# Altium project RM2022核心板V2.0.PrjPcb
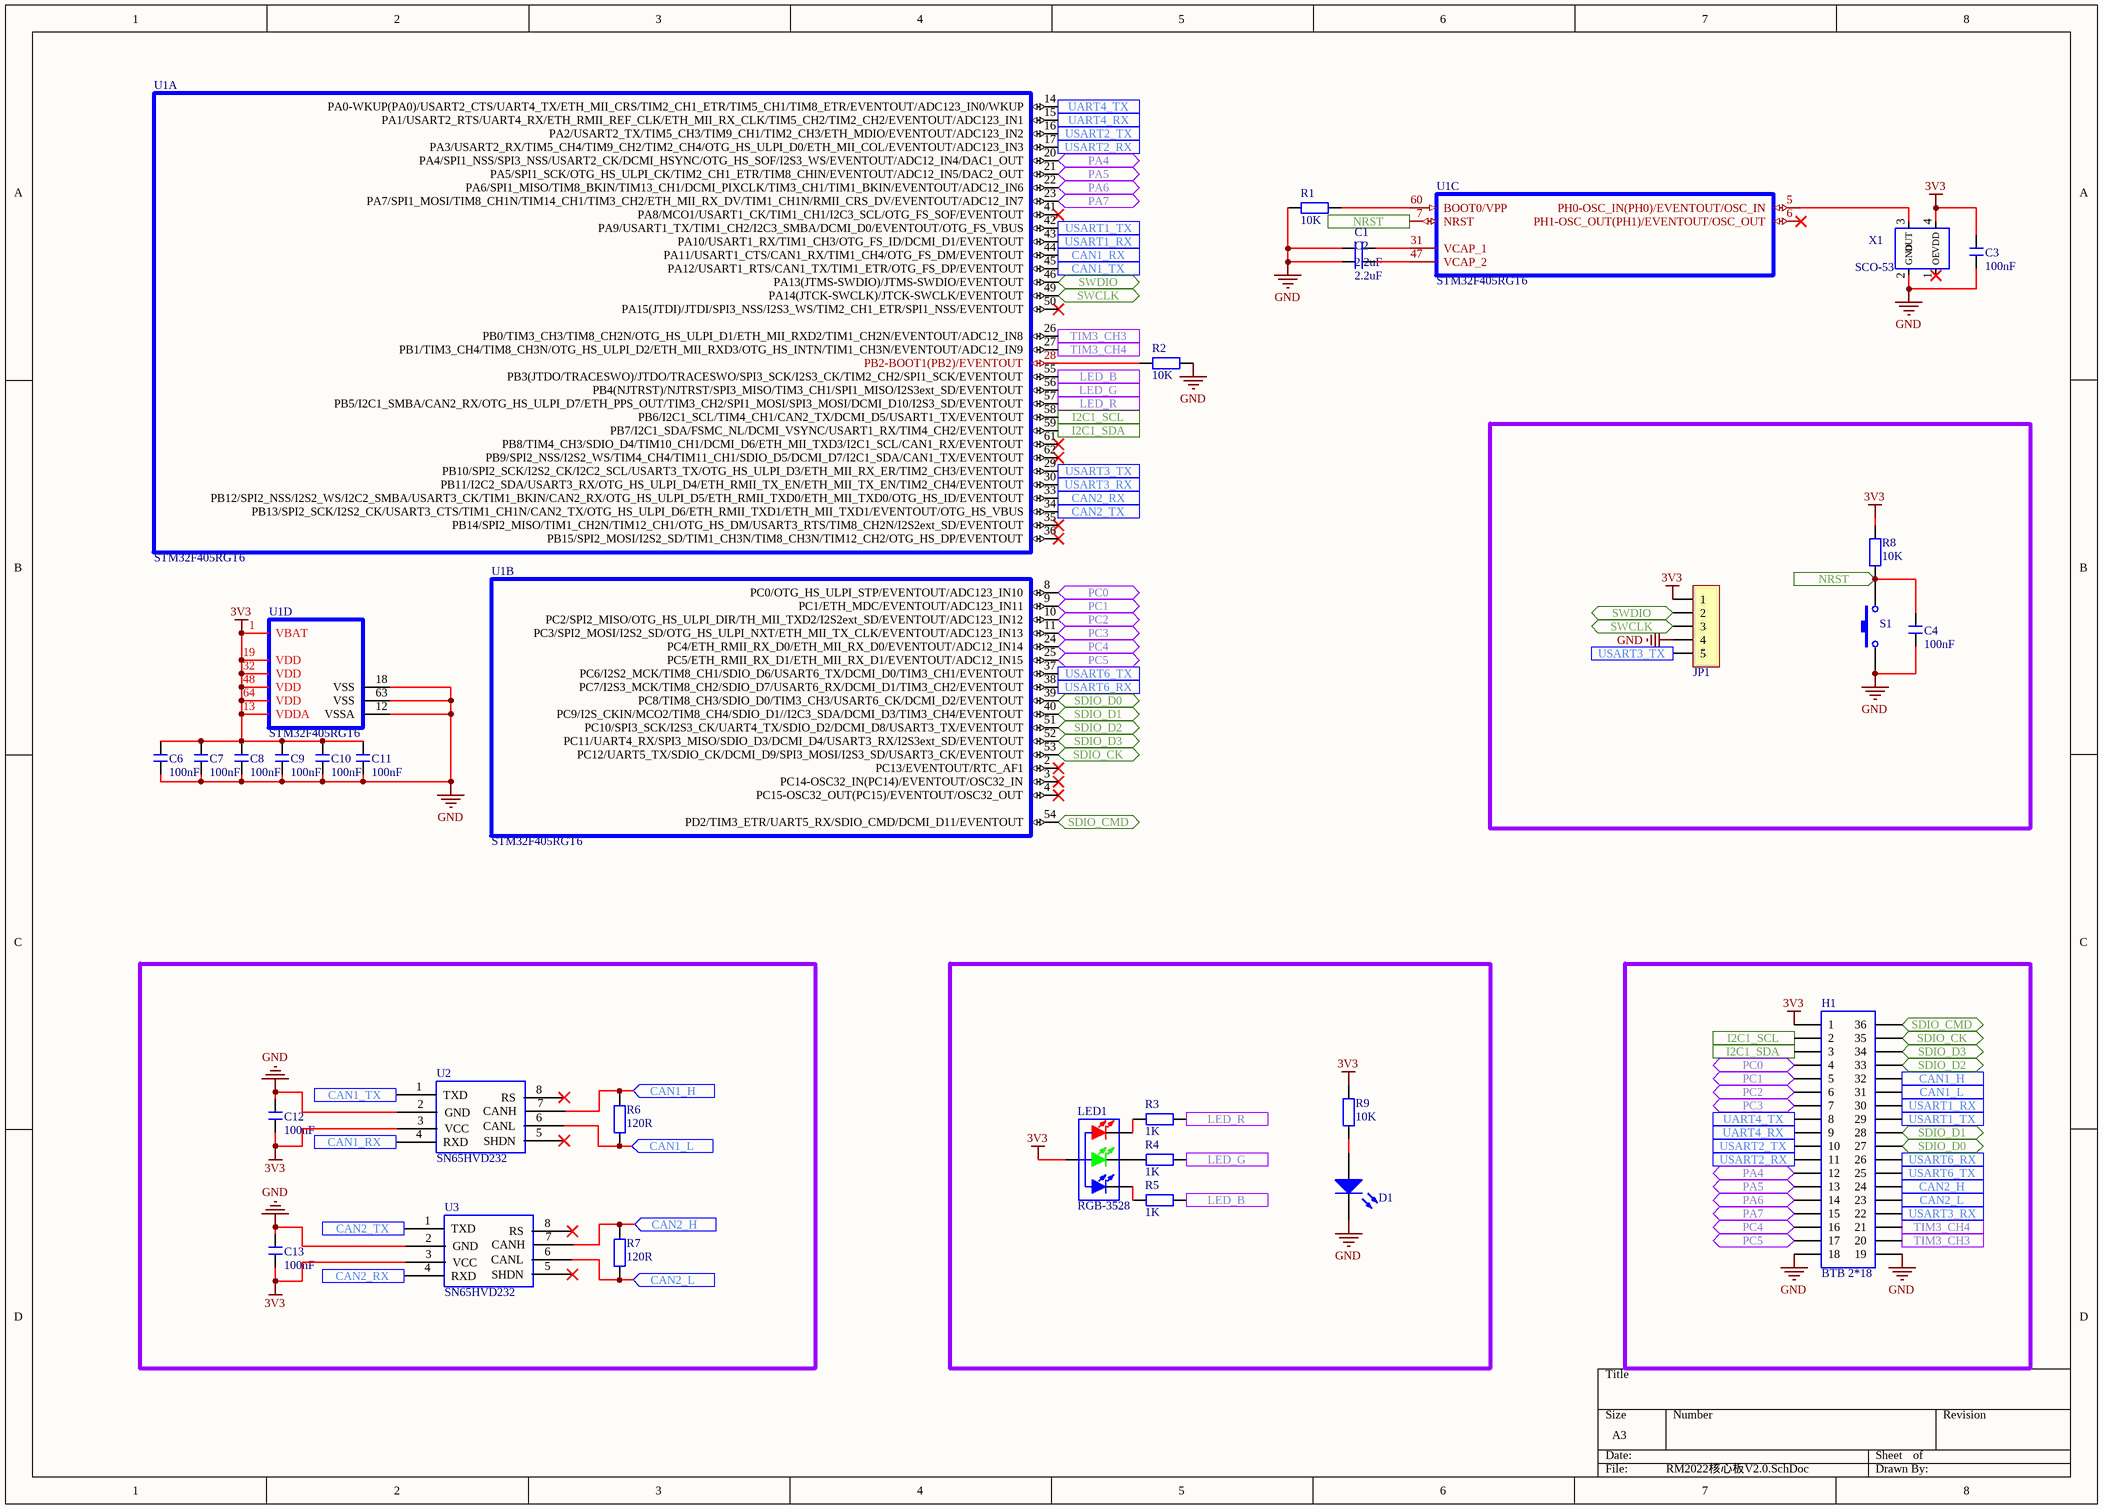
[diagram p0: RM2022核心板V2.0.SchDoc]
1 sheet, 30 parts. Net scope: flat (ports and power ports of the same name join across sheets).
Board file: RM2022核心板V2.0.PcbDoc

## Sheet RM2022核心板V2.0.SchDoc
size A3

### Parts
C1  2.2uF  [C 0402_L]
C2  2.2uF  [C 0402_L]
C3  100nF  [C 0402_L]
C4  100nF  [C 0402_L]
C6  100nF  [C 0402_L]
C7  100nF  [C 0402_L]
C8  100nF  [C 0402_L]
C9  100nF  [C 0402_L]
C10  100nF  [C 0402_L]
C11  100nF  [C 0402_L]
C12  100nF  [C 0402_L]
C13  100nF  [C 0402_L]
D1  LED  [0603_LED]  (value not drawn)
H1  BTB 2*18  [HEADER_0.8mm_2x8P_G]
JP1  HDR-1X5  [HDR2.54-LI-5P]  (value not drawn)
LED1  RGB-3528  [LED 3528-4Pin]
R1  10K  [R 0402_L]
R2  10K  [R 0402_L]
R3  1K  [R 0402_L]
R4  1K  [R 0402_L]
R5  1K  [R 0402_L]
R6  120R  [R 0402_L]
R7  120R  [R 0402_L]
R8  10K  [R 0402_L]
R9  10K  [R 0402_L]
S1  按键  [按键]  (value not drawn)
U1  STM32F405RGT6  [TQFP64_M]  (parts A,B,C,D of 4)
U2  SN65HVD232  [SOP8_N]
U3  SN65HVD232  [SOP8_N]
X1  SCO-53  [晶振]

### Ports
CAN1_H (in), CAN1_L (in), CAN1_L (out), CAN1_RX (in), CAN1_TX (in), CAN1_TX (out), CAN2_H (in), CAN2_L (in), CAN2_L (out), CAN2_RX (in), CAN2_TX (in), CAN2_TX (out), I2C1_SCL (in), I2C1_SCL (out), I2C1_SDA (in), I2C1_SDA (out), LED_B (in), LED_B (out), LED_G (in), LED_G (out), LED_R (in), LED_R (out), NRST (in), PA4 (bidir), PA5 (bidir), PA6 (bidir), PA7 (bidir), PC0 (bidir), PC1 (bidir), PC2 (bidir), PC3 (bidir), PC4 (bidir), PC5 (bidir), SDIO_CK (bidir), SDIO_CMD (bidir), SDIO_D0 (bidir), SDIO_D1 (bidir), SDIO_D2 (bidir), SDIO_D3 (bidir), SWCLK (bidir), SWDIO (bidir), TIM3_CH3 (in), TIM3_CH3 (out), TIM3_CH4 (in), TIM3_CH4 (out), UART4_RX (in), UART4_RX (out), UART4_TX (in), UART4_TX (out), USART1_RX (in), USART1_RX (out), USART1_TX (in), USART1_TX (out), USART2_RX (in), USART2_RX (out), USART2_TX (in), USART2_TX (out), USART3_RX (in), USART3_RX (out), USART3_TX (out), USART6_RX (in), USART6_RX (out), USART6_TX (in), USART6_TX (out)

### Nets
3V3: C3.2 C6.2 C7.2 C8.2 C9.2 C10.2 C11.2 C12.1 C13.1 H1.1 JP1.1 LED1.4(A) R8.2 R9.2 U1.1(VBAT) U1.13(VDDA) U1.19(VDD) U1.32(VDD) U1.48(VDD) U1.64(VDD) U2.3(VCC) U3.3(VCC) X1.4(VDD)
GND: C1.1 C2.1 C3.1 C4.1 C6.1 C7.1 C8.1 C9.1 C10.1 C11.1 C12.2 C13.2 D1.2(K) H1.18 H1.19 JP1.4 R1.1 R2.2 S1.1 U1.12(VSSA) U1.18(VSS) U1.63(VSS) U2.2(GND) U3.2(GND) X1.2(GND)
NetC1_2: C1.2 U1.31(VCAP_1)
NetC2_2: C2.2 U1.47(VCAP_2)
NetC4_2: C4.2 R8.1 S1.2 U1.7(NRST) ; port NRST
NetD1_1: D1.1(A) R9.1
NetH1_2: H1.2 U1.58(PB6/I2C1_SCL/TIM4_CH1/CAN2_TX/DCMI_D5/USART1_TX/EVENTOUT) ; port I2C1_SCL
NetH1_3: H1.3 U1.59(PB7/I2C1_SDA/FSMC_NL/DCMI_VSYNC/USART1_RX/TIM4_CH2/EVENTOUT) ; port I2C1_SDA
NetH1_4: H1.4 U1.8(PC0/OTG_HS_ULPI_STP/EVENTOUT/ADC123_IN10) ; port PC0
NetH1_5: H1.5 U1.9(PC1/ETH_MDC/EVENTOUT/ADC123_IN11) ; port PC1
NetH1_6: H1.6 U1.10(PC2/SPI2_MISO/OTG_HS_ULPI_DIR/TH_MII_TXD2/I2S2ext_SD/EVENTOUT/ADC123_IN12) ; port PC2
NetH1_7: H1.7 U1.11(PC3/SPI2_MOSI/I2S2_SD/OTG_HS_ULPI_NXT/ETH_MII_TX_CLK/EVENTOUT/ADC123_IN13) ; port PC3
NetH1_8: H1.8 U1.14(PA0-WKUP(PA0)/USART2_CTS/UART4_TX/ETH_MII_CRS/TIM2_CH1_ETR/TIM5_CH1/TIM8_ETR/EVENTOUT/ADC123_IN0/WKUP) ; port UART4_TX
NetH1_9: H1.9 U1.15(PA1/USART2_RTS/UART4_RX/ETH_RMII_REF_CLK/ETH_MII_RX_CLK/TIM5_CH2/TIM2_CH2/EVENTOUT/ADC123_IN1) ; port UART4_RX
NetH1_10: H1.10 U1.16(PA2/USART2_TX/TIM5_CH3/TIM9_CH1/TIM2_CH3/ETH_MDIO/EVENTOUT/ADC123_IN2) ; port USART2_TX
NetH1_11: H1.11 U1.17(PA3/USART2_RX/TIM5_CH4/TIM9_CH2/TIM2_CH4/OTG_HS_ULPI_D0/ETH_MII_COL/EVENTOUT/ADC123_IN3) ; port USART2_RX
NetH1_12: H1.12 U1.20(PA4/SPI1_NSS/SPI3_NSS/USART2_CK/DCMI_HSYNC/OTG_HS_SOF/I2S3_WS/EVENTOUT/ADC12_IN4/DAC1_OUT) ; port PA4
NetH1_13: H1.13 U1.21(PA5/SPI1_SCK/OTG_HS_ULPI_CK/TIM2_CH1_ETR/TIM8_CHIN/EVENTOUT/ADC12_IN5/DAC2_OUT) ; port PA5
NetH1_14: H1.14 U1.22(PA6/SPI1_MISO/TIM8_BKIN/TIM13_CH1/DCMI_PIXCLK/TIM3_CH1/TIM1_BKIN/EVENTOUT/ADC12_IN6) ; port PA6
NetH1_15: H1.15 U1.23(PA7/SPI1_MOSI/TIM8_CH1N/TIM14_CH1/TIM3_CH2/ETH_MII_RX_DV/TIM1_CH1N/RMII_CRS_DV/EVENTOUT/ADC12_IN7) ; port PA7
NetH1_16: H1.16 U1.24(PC4/ETH_RMII_RX_D0/ETH_MII_RX_D0/EVENTOUT/ADC12_IN14) ; port PC4
NetH1_17: H1.17 U1.25(PC5/ETH_RMII_RX_D1/ETH_MII_RX_D1/EVENTOUT/ADC12_IN15) ; port PC5
NetH1_20: H1.20 U1.26(PB0/TIM3_CH3/TIM8_CH2N/OTG_HS_ULPI_D1/ETH_MII_RXD2/TIM1_CH2N/EVENTOUT/ADC12_IN8) ; port TIM3_CH3
NetH1_21: H1.21 U1.27(PB1/TIM3_CH4/TIM8_CH3N/OTG_HS_ULPI_D2/ETH_MII_RXD3/OTG_HS_INTN/TIM1_CH3N/EVENTOUT/ADC12_IN9) ; port TIM3_CH4
NetH1_22: H1.22 U1.30(PB11/I2C2_SDA/USART3_RX/OTG_HS_ULPI_D4/ETH_RMII_TX_EN/ETH_MII_TX_EN/TIM2_CH4/EVENTOUT) ; port USART3_RX
NetH1_23: H1.23 R7.1 U3.6(CANL) ; port CAN2_L
NetH1_24: H1.24 R7.2 U3.7(CANH) ; port CAN2_H
NetH1_25: H1.25 U1.37(PC6/I2S2_MCK/TIM8_CH1/SDIO_D6/USART6_TX/DCMI_D0/TIM3_CH1/EVENTOUT) ; port USART6_TX
NetH1_26: H1.26 U1.38(PC7/I2S3_MCK/TIM8_CH2/SDIO_D7/USART6_RX/DCMI_D1/TIM3_CH2/EVENTOUT) ; port USART6_RX
NetH1_27: H1.27 U1.39(PC8/TIM8_CH3/SDIO_D0/TIM3_CH3/USART6_CK/DCMI_D2/EVENTOUT) ; port SDIO_D0
NetH1_28: H1.28 U1.40(PC9/I2S_CKIN/MCO2/TIM8_CH4/SDIO_D1//I2C3_SDA/DCMI_D3/TIM3_CH4/EVENTOUT) ; port SDIO_D1
NetH1_29: H1.29 U1.42(PA9/USART1_TX/TIM1_CH2/I2C3_SMBA/DCMI_D0/EVENTOUT/OTG_FS_VBUS) ; port USART1_TX
NetH1_30: H1.30 U1.43(PA10/USART1_RX/TIM1_CH3/OTG_FS_ID/DCMI_D1/EVENTOUT) ; port USART1_RX
NetH1_31: H1.31 R6.1 U2.6(CANL) ; port CAN1_L
NetH1_32: H1.32 R6.2 U2.7(CANH) ; port CAN1_H
NetH1_33: H1.33 U1.51(PC10/SPI3_SCK/I2S3_CK/UART4_TX/SDIO_D2/DCMI_D8/USART3_TX/EVENTOUT) ; port SDIO_D2
NetH1_34: H1.34 U1.52(PC11/UART4_RX/SPI3_MISO/SDIO_D3/DCMI_D4/USART3_RX/I2S3ext_SD/EVENTOUT) ; port SDIO_D3
NetH1_35: H1.35 U1.53(PC12/UART5_TX/SDIO_CK/DCMI_D9/SPI3_MOSI/I2S3_SD/USART3_CK/EVENTOUT) ; port SDIO_CK
NetH1_36: H1.36 U1.54(PD2/TIM3_ETR/UART5_RX/SDIO_CMD/DCMI_D11/EVENTOUT) ; port SDIO_CMD
NetJP1_2: JP1.2 U1.46(PA13(JTMS-SWDIO)/JTMS-SWDIO/EVENTOUT) ; port SWDIO
NetJP1_3: JP1.3 U1.49(PA14(JTCK-SWCLK)/JTCK-SWCLK/EVENTOUT) ; port SWCLK
NetJP1_5: JP1.5 U1.29(PB10/SPI2_SCK/I2S2_CK/I2C2_SCL/USART3_TX/OTG_HS_ULPI_D3/ETH_MII_RX_ER/TIM2_CH3/EVENTOUT) ; port USART3_TX
NetLED1_1: LED1.1(RED_K) R3.1
NetLED1_2: LED1.2(GREEN_K) R4.1
NetLED1_3: LED1.3(BULE_K) R5.1
NetR1_2: R1.2 U1.60(BOOT0/VPP)
NetR2_1: R2.1 U1.28(PB2-BOOT1(PB2)/EVENTOUT)
NetR3_2: R3.2 U1.57(PB5/I2C1_SMBA/CAN2_RX/OTG_HS_ULPI_D7/ETH_PPS_OUT/TIM3_CH2/SPI1_MOSI/SPI3_MOSI/DCMI_D10/I2S3_SD/EVENTOUT) ; port LED_R
NetR4_2: R4.2 U1.56(PB4(NJTRST)/NJTRST/SPI3_MISO/TIM3_CH1/SPI1_MISO/I2S3ext_SD/EVENTOUT) ; port LED_G
NetR5_2: R5.2 U1.55(PB3(JTDO/TRACESWO)/JTDO/TRACESWO/SPI3_SCK/I2S3_CK/TIM2_CH2/SPI1_SCK/EVENTOUT) ; port LED_B
NetU1_5: U1.5(PH0-OSC_IN(PH0)/EVENTOUT/OSC_IN) X1.3(OUT)
NetU1_33: U1.33(PB12/SPI2_NSS/I2S2_WS/I2C2_SMBA/USART3_CK/TIM1_BKIN/CAN2_RX/OTG_HS_ULPI_D5/ETH_RMII_TXD0/ETH_MII_TXD0/OTG_HS_ID/EVENTOUT) U3.4(RXD) ; port CAN2_RX
NetU1_34: U1.34(PB13/SPI2_SCK/I2S2_CK/USART3_CTS/TIM1_CH1N/CAN2_TX/OTG_HS_ULPI_D6/ETH_RMII_TXD1/ETH_MII_TXD1/EVENTOUT/OTG_HS_VBUS) U3.1(TXD) ; port CAN2_TX
NetU1_44: U1.44(PA11/USART1_CTS/CAN1_RX/TIM1_CH4/OTG_FS_DM/EVENTOUT) U2.4(RXD) ; port CAN1_RX
NetU1_45: U1.45(PA12/USART1_RTS/CAN1_TX/TIM1_ETR/OTG_FS_DP/EVENTOUT) U2.1(TXD) ; port CAN1_TX

Not connected (* = marked no-connect by the designer): U1 2(PC13/EVENTOUT/RTC_AF1)* 3(PC14-OSC32_IN(PC14)/EVENTOUT/OSC32_IN)* 4(PC15-OSC32_OUT(PC15)/EVENTOUT/OSC32_OUT)* 6(PH1-OSC_OUT(PH1)/EVENTOUT/OSC_OUT)* 35(PB14/SPI2_MISO/TIM1_CH2N/TIM12_CH1/OTG_HS_DM/USART3_RTS/TIM8_CH2N/I2S2ext_SD/EVENTOUT)* 36(PB15/SPI2_MOSI/I2S2_SD/TIM1_CH3N/TIM8_CH3N/TIM12_CH2/OTG_HS_DP/EVENTOUT)* 41(PA8/MCO1/USART1_CK/TIM1_CH1/I2C3_SCL/OTG_FS_SOF/EVENTOUT)* 50(PA15(JTDI)/JTDI/SPI3_NSS/I2S3_WS/TIM2_CH1_ETR/SPI1_NSS/EVENTOUT)* 61(PB8/TIM4_CH3/SDIO_D4/TIM10_CH1/DCMI_D6/ETH_MII_TXD3/I2C1_SCL/CAN1_RX/EVENTOUT)* 62(PB9/SPI2_NSS/I2S2_WS/TIM4_CH4/TIM11_CH1/SDIO_D5/DCMI_D7/I2C1_SDA/CAN1_TX/EVENTOUT)*; U2 5(SHDN)* 8(RS)*; U3 5(SHDN)* 8(RS)*; X1 1(OE)*

### Library data of the parts
C1-C4 C6-C13 = C: 贴片电容; BOM名称: 无极性贴片电容; 淘宝ID: 封装库来自淘宝 ID：黄晶宝石; 联系售后，技术支持: https://shop463601444.taobao.com; 唯一出售店铺网址: https://shop463601444.taobao.com
D1 = LED: Typical RED, GREEN, YELLOW, AMBER GaAs LED; Published: 8-Jun-2000; LatestRevisionDate: 17-Jul-2002; LatestRevisionNote: Re-released for DXP Platform.; PackageDocument: Feb-2002; PackageReference: 3.2X1.6X1.1; Publisher: Altium Limited
JP1 = Header 5: 5P接插件; 版权归属: 封装库来自淘宝 ID：黄晶宝石; BOM名称: 5P接插件; 学习资源: https://shop463601444.taobao.com
LED1 = LED-RGB 3528: 3528三基色LED; BOM名称: 三基色LED; 版权归属: 封装库来自淘宝 ID：黄晶宝石; 封装库来自淘宝卖家 ID：黄晶宝石: 其他店铺购入均为盗版，不享受售后技术支持服务，请立即申请退款; 学习资源: https://shop463601444.taobao.com
R1-R9 = R: 贴片电阻; 版权归属: 来自淘宝 ID：黄晶宝石; 封装库来自淘宝卖家 ID：黄晶宝石: 其他店铺购入均为盗版，不享受售后技术支持服务，请立即申请退款; BOM名称: 贴片电阻; 联系售后: https://shop463601444.taobao.com
S1 = 按键: Switch; Published: 24-Mar-1999; LatestRevisionDate: 17-Jul-2002; LatestRevisionNote: Re-released for DXP Platform.; PackageReference: SPST-2; Publisher: Altium Limited; PackageDescription: Switch; 2 Leads
U1 = STM32F405RGT6: ARM Cortex-M4 32b MCU+FPU, 210DMIP, 1024 kB Flash, 192+4 kB RAM, 51 I/Os, 64-pin LQFP, -40 to +85癈, Tray; Internal RAM: 192kB; Operating Frequency (Processor Speed): 168MHz; A/D Converter: 16x12-bit; D/A Converter: 2x12-bit; 16-bit Timers (IC/OC/PWM): 12x16-bit(24/24/30); 32-bit Timer (IC/OC/PWM): 2x32-bit (8/8/8); Other Timer Functions: 2xWDG, RTC, 24-bit down counter; Serial Interface: 3xSPI/2xI2S/2xI2C/3xUSART(IrDa, ISO7816)/3xUART/1xUSB OTG FS/HS, 2xCAN/ SDIO; DatasheetVersion: rev2, Jan-2012; PackageVersion: 2012; PackageReference: TQFP64; PackageDescription: 64-Pin Low Profile Quad Flat Package, 10x10 mm Body, 0.5 mm Pitch; ComponentLink1Description: Manufacturer URL; ComponentLink1URL: http://www.st.com/; ComponentLink2Description: STM32F405/7 Datasheet; ComponentLink2URL: http://www.st.com/internet/com/TECHNICAL_RESOURCES/TECHNICAL_LITERATURE/DATASHEET/DM00037051.pdf; ComponentLink3Description: STM32F4 Web Page; ComponentLink3URL: http://www.st.com/internet/mcu/subclass/1521.jsp
U2 U3 = CAN芯片
X1 = 晶振